# Altium schematic sheet 5v_dcdc_blk.SchDoc
size A4; Engineer: JBayalas; DocumentNumber: 13; Revision: V1.1; SheetNumber: 13; SheetTotal: 13
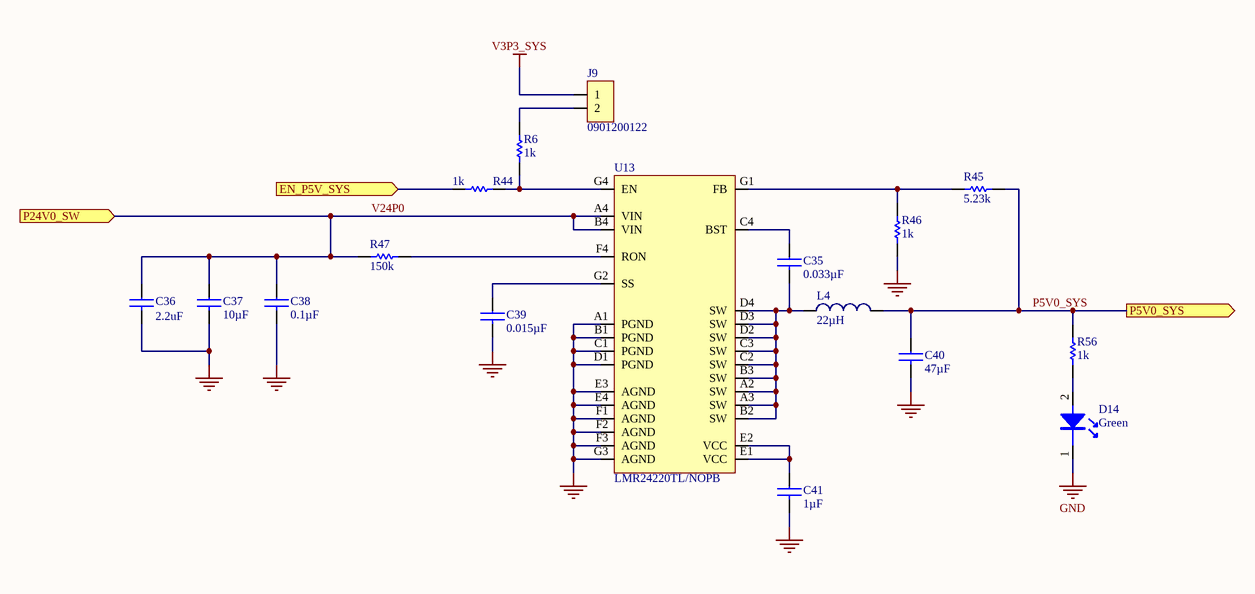
[diagram p0: 5v_dcdc_blk.SchDoc]

## Parts
C35  value 0.033µF  [C0402]  (hidden comment: *)
C36  value 2.2uF  [C0603]  (hidden comment: *)
C37  value 10µF  [C1210]  (hidden comment: *)
C38  value 0.1µF  [C0805]  (hidden comment: *)
C39  value 0.015µF  [C0402]  (hidden comment: *)
C40  value 47µF  [C1206]  (hidden comment: *)
C41  value 1µF  [C0603]  (hidden comment: *)
D14  value Green  [LED0402(GREEN)]  (hidden comment: *)
J9  *  [0901200122]  (value not drawn)
L4  value 22µH  [MPI4040R3-220-R]  (hidden comment: MPI4040R3-220-R)
R6  value 1k  [R0603]  (hidden comment: *)
R44  value 1k  [R0402]  (hidden comment: *)
R45  value 5.23k  [R0402]  (hidden comment: *)
R46  value 1k  [R0402]  (hidden comment: *)
R47  value 150k  [R0402]  (hidden comment: *)
R56  value 1k  [R0603]  (hidden comment: *)
U13  *  [DSBGA-28]  (value not drawn)

## Ports
EN_P5V_SYS (in), P5V0_SYS (out), P24V0_SW (in)

## Nets
GND: C36.2 C37.2 C38.2 C39.2 C40.2 C41.2 D14.1 R46.2 U13.A1(PGND) U13.B1(PGND) U13.C1(PGND) U13.D1(PGND) U13.E3(AGND) U13.E4(AGND) U13.F1(AGND) U13.F2(AGND) U13.F3(AGND) U13.G3(AGND)
V3P3_SYS: J9.1
EN_P5V_SYS: R44.2 ; port EN_P5V_SYS
P5V0_SYS: C40.1 L4.1 R45.1 R56.2 ; port P5V0_SYS
V24P0: C36.1 C37.1 C38.1 R47.2 U13.A4(VIN) U13.B4(VIN) ; port P24V0_SW
NetC35_1: C35.1 U13.C4(BST)
NetC35_2: C35.2 L4.2 U13.A2(SW) U13.A3(SW) U13.B2(SW) U13.B3(SW) U13.C2(SW) U13.C3(SW) U13.D2(SW) U13.D3(SW) U13.D4(SW)
NetC39_1: C39.1 U13.G2(SS)
NetC41_1: C41.1 U13.E1(VCC) U13.E2(VCC)
NetD14_2: D14.2 R56.1
NetJ9_2: J9.2 R6.2
NetR6_1: R6.1 R44.1 U13.G4(EN)
NetR45_2: R45.2 R46.1 U13.G1(FB)
NetR47_1: R47.1 U13.F4(RON)

## Notes on the sheet
- Title:
- Sheet:
- Date:
- of
- Project:
- Revision:
- Engineer:
- Wi4B S.r.l

## Library data of the parts
C35 = GRM155R71E333KA88D: CAP CER 0.033UF 25V X7R 0402; MFT: Murata; TYPE: Surface Mount; FUNCTION: 5v_dcdc; MPN: GRM155R71E333KA88D; RATING: 25V
C36 = C1608X5R1V225K080AC: CAP CER 2.2UF 35V X5R 0603; MFT: TDK Corporation; TYPE: SMD; FUNCTION: 5v_dcdc; MPN: C1608X5R1V225K080AC; RATING: 35V; LOAD: *
C37 = GRM32ER7YA106KA12L: CAP CER 10UF 35V X7R 1210; MFT: Murata Electronics North America; TYPE: Surface Mount, MLCC; FUNCTION: 5v_dcdc; MPN: GRM32ER7YA106KA12L; RATING: 35V
C38 = C0805C104K5RACTU: CAP CER 0.1UF 50V X7R 0805; MFT: Kemet; TYPE: Surface Mount, MLCC; FUNCTION: 5v_dcdc; MPN: C0805C104K5RACTU; RATING: 50V
C39 = GRM155R71E153KA61D: CAP CER 0.015UF 25V X7R 0402; TYPE: Surface Mount, MLCC; MFT: Murata Electronics North America; FUNCTION: 5v_dcdc; RATING: 25V; MPN: GRM155R71E153KA61D
C40 = GRM31CR61A476KE15L: CAP CER 47UF 10V X5R 1206; MFT: Murata Electronics North America; TYPE: Surface Mount, MLCC; FUNCTION: 5v_dcdc; MPN: GRM31CR61A476KE15L; RATING: 10V
C41 = GRM188R61E105KA12D: CAP CER 1UF 25V X5R 0603; MFT: Murata Electronics North America; TYPE: Surface Mount; FUNCTION: 5v_dcdc; MPN: GRM188R61E105KA12D; RATING: 25V
D14 = LNJ347W83RA: LED GREEN 0402 SMD; MFT: Panasonic Electronic Components; TYPE: Surface Mount; FUNCTION: 5v_dcdc; MPN: LNJ347W83RA
J9 = 0901200122: CONN HEADER 2POS .100" STR TIN; MFT: Molex, LLC; FUNCTION: 5v_dcdc; TYPE: Through Hole; VALUE: 0901200122; MPN: 0901200122
L4 = MPI4040R3-220-R: FIXED IND 22UH 1.1A 408 MOHM SMD; MFT: Eaton Bussmann; FUNCTION: 5v_dcdc; MPN: MPI4040R3-220-R; TYPE: SMD; RATING: 1.1A 408 MOHM; DNP: *
R6 = 6-1879336-2: RES SMD 1K OHM 1% 1/16W 0603; MFT: TE Connectivity AMP Connectors; RATING: 0.063W; FUNCTION: 5v_dcdc; MPN: 6-1879336-2; TYPE: SMD; LOAD: *
R44 R46 = CRCW04021K00FKED: RES SMD 1K OHM 1% 1/16W 0402; RATING: 0.063W; MFT: Vishay Dale; FUNCTION: 5v_dcdc; MPN: CRCW04021K00FKED; TYPE: Surface Mount
R45 = CRCW04025K23FKED: RES SMD 5.23K OHM 1% 1/16W 0402; RATING: 0.063W; MFT: Vishay Dale; FUNCTION: 5v_dcdc; TYPE: Surface Mount; MPN: CRCW04025K23FKED
R47 = CRCW0402150KFKED: RES SMD 150K OHM 1% 1/16W 0402; MFT: Vishay Dale; RATING: 63mW; FUNCTION: 5v_dcdc; MPN: CRCW0402150KFKED; TYPE: Surface Mount
R56 = ERJ-3EKF1001V: RES SMD 1K OHM 1% 1/10W 0603; MFT: Panasonic Electronic Components; RATING: 0.1W; FUNCTION: 5v_dcdc; MPN: ERJ-3EKF1001V; TYPE: Surface Mount
U13 = LMR24220TL/NOPB: Voltage Regulators - Switching Regulators 42VIN,2A SIMPLE SW NANO STEP-DOWN REG; MFT: Texas Instruments; FUNCTION: 5v_dcdc; TYPE: Surface Mount; VALUE: LMR24220TL/NOPB; MPN: LMR24220TL/NOPB